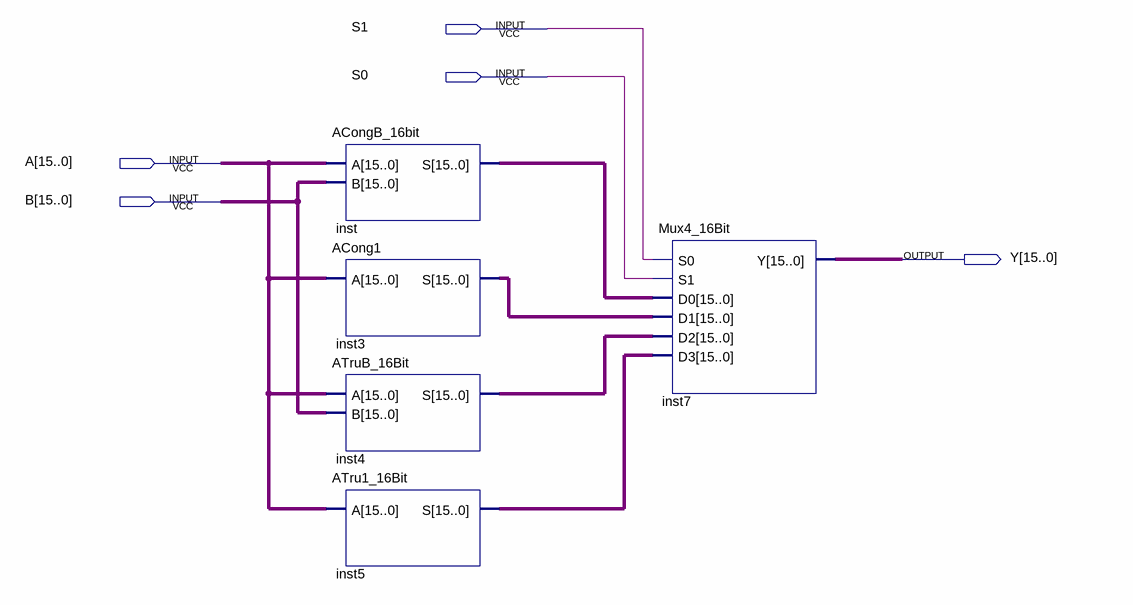
[diagram p0: schematic sheet]
// Quartus schematic AU_16Bit.bdf as structural Verilog: 5 symbols, 5 pins
module AU_16Bit (
  input  S1,
  input  S0,
  input  [15:0] A,
  input  [15:0] B,
  output [15:0] Y
);

  wire [15:0] inst3_s, inst4_s, inst5_s, inst_s;

  ACongB_16bit inst (.A(A), .B(B), .S(inst_s));
  ACong1 inst3 (.A(A), .S(inst3_s));
  ATruB_16Bit inst4 (.A(A), .B(B), .S(inst4_s));
  ATru1_16Bit inst5 (.A(A), .S(inst5_s));
  Mux4_16Bit inst7 (.S0(S1), .S1(S0), .D0(inst_s), .D1(inst3_s), .D2(inst4_s), .D3(inst5_s), .Y(Y));
endmodule
